# Altium project EduSAT-Sensor.PrjPcb
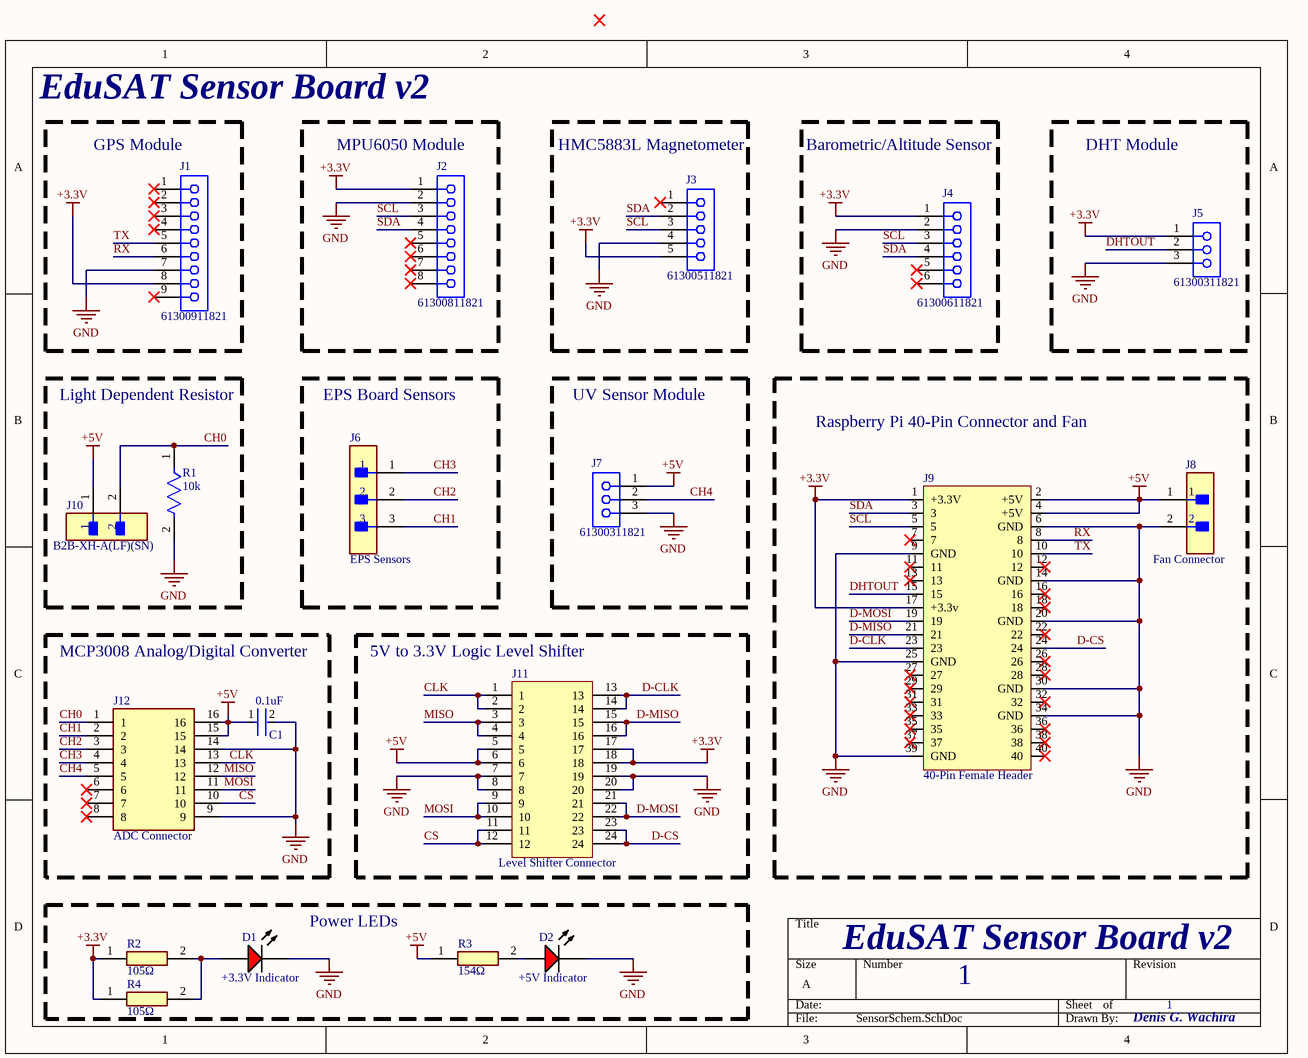
[diagram p0: SensorSchem.SchDoc]
1 sheet, 19 parts. Net scope: global (net labels, ports and power ports of the same name join across sheets).
Board file: SensorBoard.PcbDoc

## Sheet SensorSchem.SchDoc
size A; SheetNumber: 1; SheetTotal: 1

### Parts
C1  0.1uF  [FP-CL21-IPC_A]
D1  +3.3V Indicator  [LTST-C170KRKT_V]
D2  +5V Indicator  [LTST-C170KRKT_V]
J1  61300911821  [61300911821]
J2  61300811821  [61300811821]
J3  61300511821  [61300511821]
J4  61300611821  [61300611821]
J5  61300311821  [61300311821]
J6  EPS Sensors  [FP-S3B-XH-A-1_LF_SN-MFG]
J7  61300311821  [61300311821]
J8  Fan Connector  [FP-B2B-XH-A_LF_SN-MFG]
J9  40-Pin Female Header  [FP-7-534206-0-MFG]
J10  B2B-XH-A(LF)(SN)  [FP-B2B-XH-A_LF_SN-MFG]
J11  Level Shifter Connector  [61301221821]
J12  ADC Connector  [AMPHENOL_DILB16P-223TLF]
R1  10k  [FP-MCR10-IPC_C]
R2  105Ω  [RESC2012X65N]
R3  154Ω  [RESC2012X65N]
R4  105Ω  [RESC2012X65N]

### Blocks framed on the sheet
GPS Module: J1
MPU6050 Module: J2
HMC5883L Magnetometer: J3
Barometric/Altitude Sensor: J4
DHT Module: J5
Light Dependent Resistor: J10 R1
EPS Board Sensors: J6
UV Sensor Module: J7
Raspberry Pi 40-Pin Connector and Fan: J8 J9
MCP3008 Analog/Digital Converter: C1 J12
5V to 3.3V Logic Level Shifter: J11
Power LEDs: D1 D2 R2-R4

### Nets
+3.3V: J1.8 J2.1 J3.5 J4.1 J5.1 J9.1(+3.3V) J9.17(+3.3v) J11.17 J11.18 R2.1 R4.1
+5V: C1.1 J7.1 J8.1 J9.2(+5V) J9.4(+5V) J10.1 J11.5 J11.6 J12.15 J12.16 R3.1
GND: C1.2 D1.2(K) D2.2(K) J1.7 J2.2 J3.4 J4.2 J5.3 J7.3 J8.2 J9.6(GND) J9.9(GND) J9.14(GND) J9.20(GND) J9.25(GND) J9.30(GND) J9.34(GND) J9.39(GND) J11.7 J11.8 J11.19 J11.20 J12.9 J12.14 R1.2
CH0: J10.2 J12.1 R1.1
CH1: J6.3 J12.2
CH2: J6.2 J12.3
CH3: J6.1 J12.4
CH4: J7.2 J12.5
CLK: J11.1 J11.2 J12.13
CS: J11.11 J11.12 J12.10
D-CLK: J9.23 J11.13 J11.14
D-CS: J9.24 J11.23 J11.24
D-MISO: J9.21 J11.15 J11.16
D-MOSI: J9.19 J11.21 J11.22
DHTOUT: J5.2 J9.15
MISO: J11.3 J11.4 J12.12
MOSI: J11.9 J11.10 J12.11
RX: J1.6 J9.8
SCL: J2.3 J3.3 J4.3 J9.5
SDA: J2.4 J3.2 J4.4 J9.3
TX: J1.5 J9.10
NetD1_1: D1.1(A) R2.2 R4.2
NetD2_1: D2.1(A) R3.2

Not connected (* = marked no-connect by the designer): J1 1* 2* 3* 4* 9*; J2 5* 6* 7* 8*; J3 1*; J4 5* 6*; J9 7* 11* 12* 13* 16* 18* 22* 26* 27* 28* 29* 31* 32* 33* 35* 36* 37* 38* 40*; J12 6* 7* 8*

### Notes on the sheet
- EduSAT Sensor Board v2
- Denis G. Wachira

### Library data of the parts
C1 = CMP-13271-002975-1: 50V 0.1uF X7R ±10% 0805 Multilayer Ceramic Capacitors MLCC - SMD/SMT ROHS TCC0805X7R104K500DT; Case Code (Imperial): 0805; Length: 2mm; Case/Package: 0805; Packaging: Tape and Reel; Width: 0.049inch; Tolerance: 10%; Mount: Surface Mount; Min Operating Temperature: -55°C; Thickness: 0.057inch; Height: 1.25mm; Dielectric: X7R; Package Quantity: 1; Depth: 1.25mm; Capacitance: 0.1uF; Voltage Rating: 50V; Case Code (Metric): 2012; Max Operating Temperature: 85°C; Radiation Hardening: No
D1 D2 = CMP-2000-07593-1: LED Red,KT-0805R; Manufacturer: Lite-On; Lens Transparency: Clear; Number of Elements: 1; Power Rating: 75mW; Luminous Intensity: 54mcd; Viewing Angle: 130degrees; Forward Current: 30mA; Wavelength: 639nm; Lens Style: Rectangular; Case\/Package: 0805; Test Current: 20mA; Dominant Wavelength: 631nm; Forward Voltage: 2V; Lens Colour: Colorless; Min Operating Temperature: -55degC; RoHSCompliant: True; Length: 3.2mm; Width: 1.25mm; Mount: SurfaceMount; Packaging: TapeandReel; Number of LEDs: 1; Radiation Hardening: No; Datasheet URL: http://optoelectronics.liteon.com/upload/download/DS-22-99-0150/LTST-C170KRKT.pdf; Datasheet Version: Rev. D, 11/2014; Case Code (Metric): 2012; Height: 1.1mm; Number of Pins: 2; Package Description: 2-Pin Surface Mount Device, Body 2 x 1.25 mm; Manufacturer URL: http://www.us.liteon.com/; Lead Free: LeadFree; Illumination Colour: Red; Colour: Red; Case Code (Imperial): 0805; Max Operating Temperature: 85degC; Power Dissipation: 75mW; Mounting Technology: SurfaceMount; Package Reference: C170KRKT; Package Quantity: 1; Depth: 1.6mm
J1 = CMP-1502-01331-3: NexarPartId: 61924727; Contact Resistance: 20mΩ; Gender: Female; Operating Supply Voltage: 250V; Current Rating: 3A; Number of Pins: 9; Lead Pitch: 2.54mm; RoHS: Non-Compliant; Orientation: Vertical
J2 = CMP-1502-01327-3: NexarPartId: 61924723; Current Rating: 3A; Gender: Female; Contact Resistance: 20mΩ; Operating Supply Voltage: 250V; Lead Pitch: 2.54mm; RoHS: Non-Compliant; Orientation: Vertical; Number of Pins: 8
J3 = CMP-1502-01320-3: NexarPartId: 61924716; Current Rating: 3A; Operating Supply Voltage: 250V; Gender: Female; Contact Resistance: 20mΩ; Lead Pitch: 2.54mm; Orientation: Vertical; RoHS: Non-Compliant; Number of Pins: 5
J4 = CMP-1502-01322-3: NexarPartId: 21642411; Current Rating: 3A; Operating Supply Voltage: 250V; Contact Resistance: 20mΩ; Gender: Female; Number of Pins: 6; Orientation: Vertical; Lead Pitch: 2.54mm; RoHS: Compliant
J5 J7 = CMP-1502-01315-3: NexarPartId: 61924710; Contact Resistance: 20mΩ; Current Rating: 3A; Gender: Female; Operating Supply Voltage: 250V; RoHS: Non-Compliant; Number of Pins: 3; Orientation: Vertical; Lead Pitch: 2.54mm
J6 = CMP-17439-000427-1: CONN HEADER R/A 3POS 2.5MM / HCZZ0139-3; Voltage Rating: 250V; Pitch: 0.098inch; Number of Positions: 3; Contact Finish - Mating: TIN; Mount: Through Hole; Lead Free: Lead Free; Termination: Press-Fit; Fastening Type: Detent; Insulation Material: Nylon; Min Operating Temperature: -25°C; Flammability Rating: UL94 V-0; Number of Rows: 1; Contact Plating: Tin; Max Operating Temperature: 85°C; Color: Natural; Package Quantity: 1000; Insulation Color: Natural; Contact Material: Brass; Series: XH; Connector Type: Header; Contact Shape: Square; Packaging: Bulk; Contact Type: Male Pin
J8 J10 = CMP-2000-05888-3: CONN HEADER VERT 2POS 2.5MM; Current Rating: 3A; Voltage Rating: 250V; Number of Contacts: 2; Contact Resistance: 20mR; Wire/Cable Gauge: 22AWG; Insulation Resistance: 1GR; Connector Type: Male Pin; Packaging: Bulk; Contact Material: Brass; Lead Free: Lead Free; Orientation: Straight; Contact Plating: Tin; Max Current Rating: 3A; Termination: Solder; Fastening Type: Detent; Depth: 5.75mm; Housing Material: Polyamide; REACH SVHC: No SVHC; Series: XH; Voltage Rating (AC): 250V; Number of Positions: 2; Color: Natural; Contact Type: Male Pin; Max Voltage Rating (DC): 250V; Pitch: 2.5mm; Lead Pitch: 2.5mm; Mount: Through Hole; Max Operating Temperature: 85°C; Length: 7.4mm; Max Voltage Rating (AC): 250V; Min Operating Temperature: -25°C; Number of Rows: 1; Housing Color: White
J9 = CMP-002-00081-2: Board Connector, 40 Contact(s), 2 Row(s), Female, Straight, 0.1 inch Pitch, Solder Terminal, Locking, Black Insulator, Receptacle; Min Operating Temperature: -65°C; Connector Type: BOARD CONNECTOR; Mounting Technology: Board; RoHS Compliant: Yes; Max Operating Temperature: 105°C
J11 = CMP-002-00083-1: 3.3V to 5V Level Shifter Connector; Connector Type: BOARD CONNECTOR; Max Operating Temperature: 125°C; Mounting Technology: Board; Min Operating Temperature: -40°C; RoHS Compliant: Yes
J12 = CMP-002-00080-2: DIP Socket, Stamped and Formed; MF: Amphenol ICC (FCI); Availability: In Stock; Value: *; Component Type: Standard; Check_prices: https://www.snapeda.com/parts/DILB16P-223TLF/Amphenol+FCI/view-part/?ref=eda; Design Item ID: DILB16P-223TLF; Case/Package: None; MP: DILB16P-223TLF; Source: DILB16P-223TLF.SchLib; Price: None; Pins: 16; SnapEDA_Link: https://www.snapeda.com/parts/DILB16P-223TLF/Amphenol+FCI/view-part/?ref=snap
R1 = CMP-08839-012433-1: Thick Film Chip Resistor, 0805, 10kΩ, 1%, 100ppm/°C, 0.125W, 150V / 0805W8F1002T5E; Resistance: 10kR; Power Rating: 125mW; Resistor Type: Thick Film; Contact Plating: Tin; Length: 2mm; Tolerance: 1%; Temperature Coefficient: 100ppm/°C; Max Operating Temperature: 155°C; Min Operating Temperature: -55°C; Height: 550um; Voltage Rating (DC): 150V; Mount: Surface Mount; Case/Package: 0805; Lead Free: Lead Free; Width: 1.25mm; Radiation Hardening: No; Working Voltage: 150V; Number of Terminations: 2
R2 R4 = AECR0805F27R0K9: 125mW Thick Film Resistors 150V ±100ppm/℃ ±1% 105Ω 0805 Chip Resistor - Surface Mount ROHS CR0805F105RP05Z; Manufacturer_Name: ResistorToday; Datasheet Link: https://datasheet.lcsc.com/lcsc/2304140030_RESI-AECR0805F27R0K9_C352233.pdf; Height: 0.65mm; Manufacturer_Part_Number: AECR0805F27R0K9
R3 = AECR0805F27R0K9: 125mW Thick Film Resistors 150V ±100ppm/℃ ±1% 154Ω 0805 Chip Resistor - Surface Mount ROHS CR0805F81540G; Manufacturer_Name: ResistorToday; Datasheet Link: https://datasheet.lcsc.com/lcsc/2304140030_RESI-AECR0805F27R0K9_C352233.pdf; Height: 0.65mm; Manufacturer_Part_Number: AECR0805F27R0K9